# EAGLE board M1709 (EAGLE 6.6.0), part 1 of 2
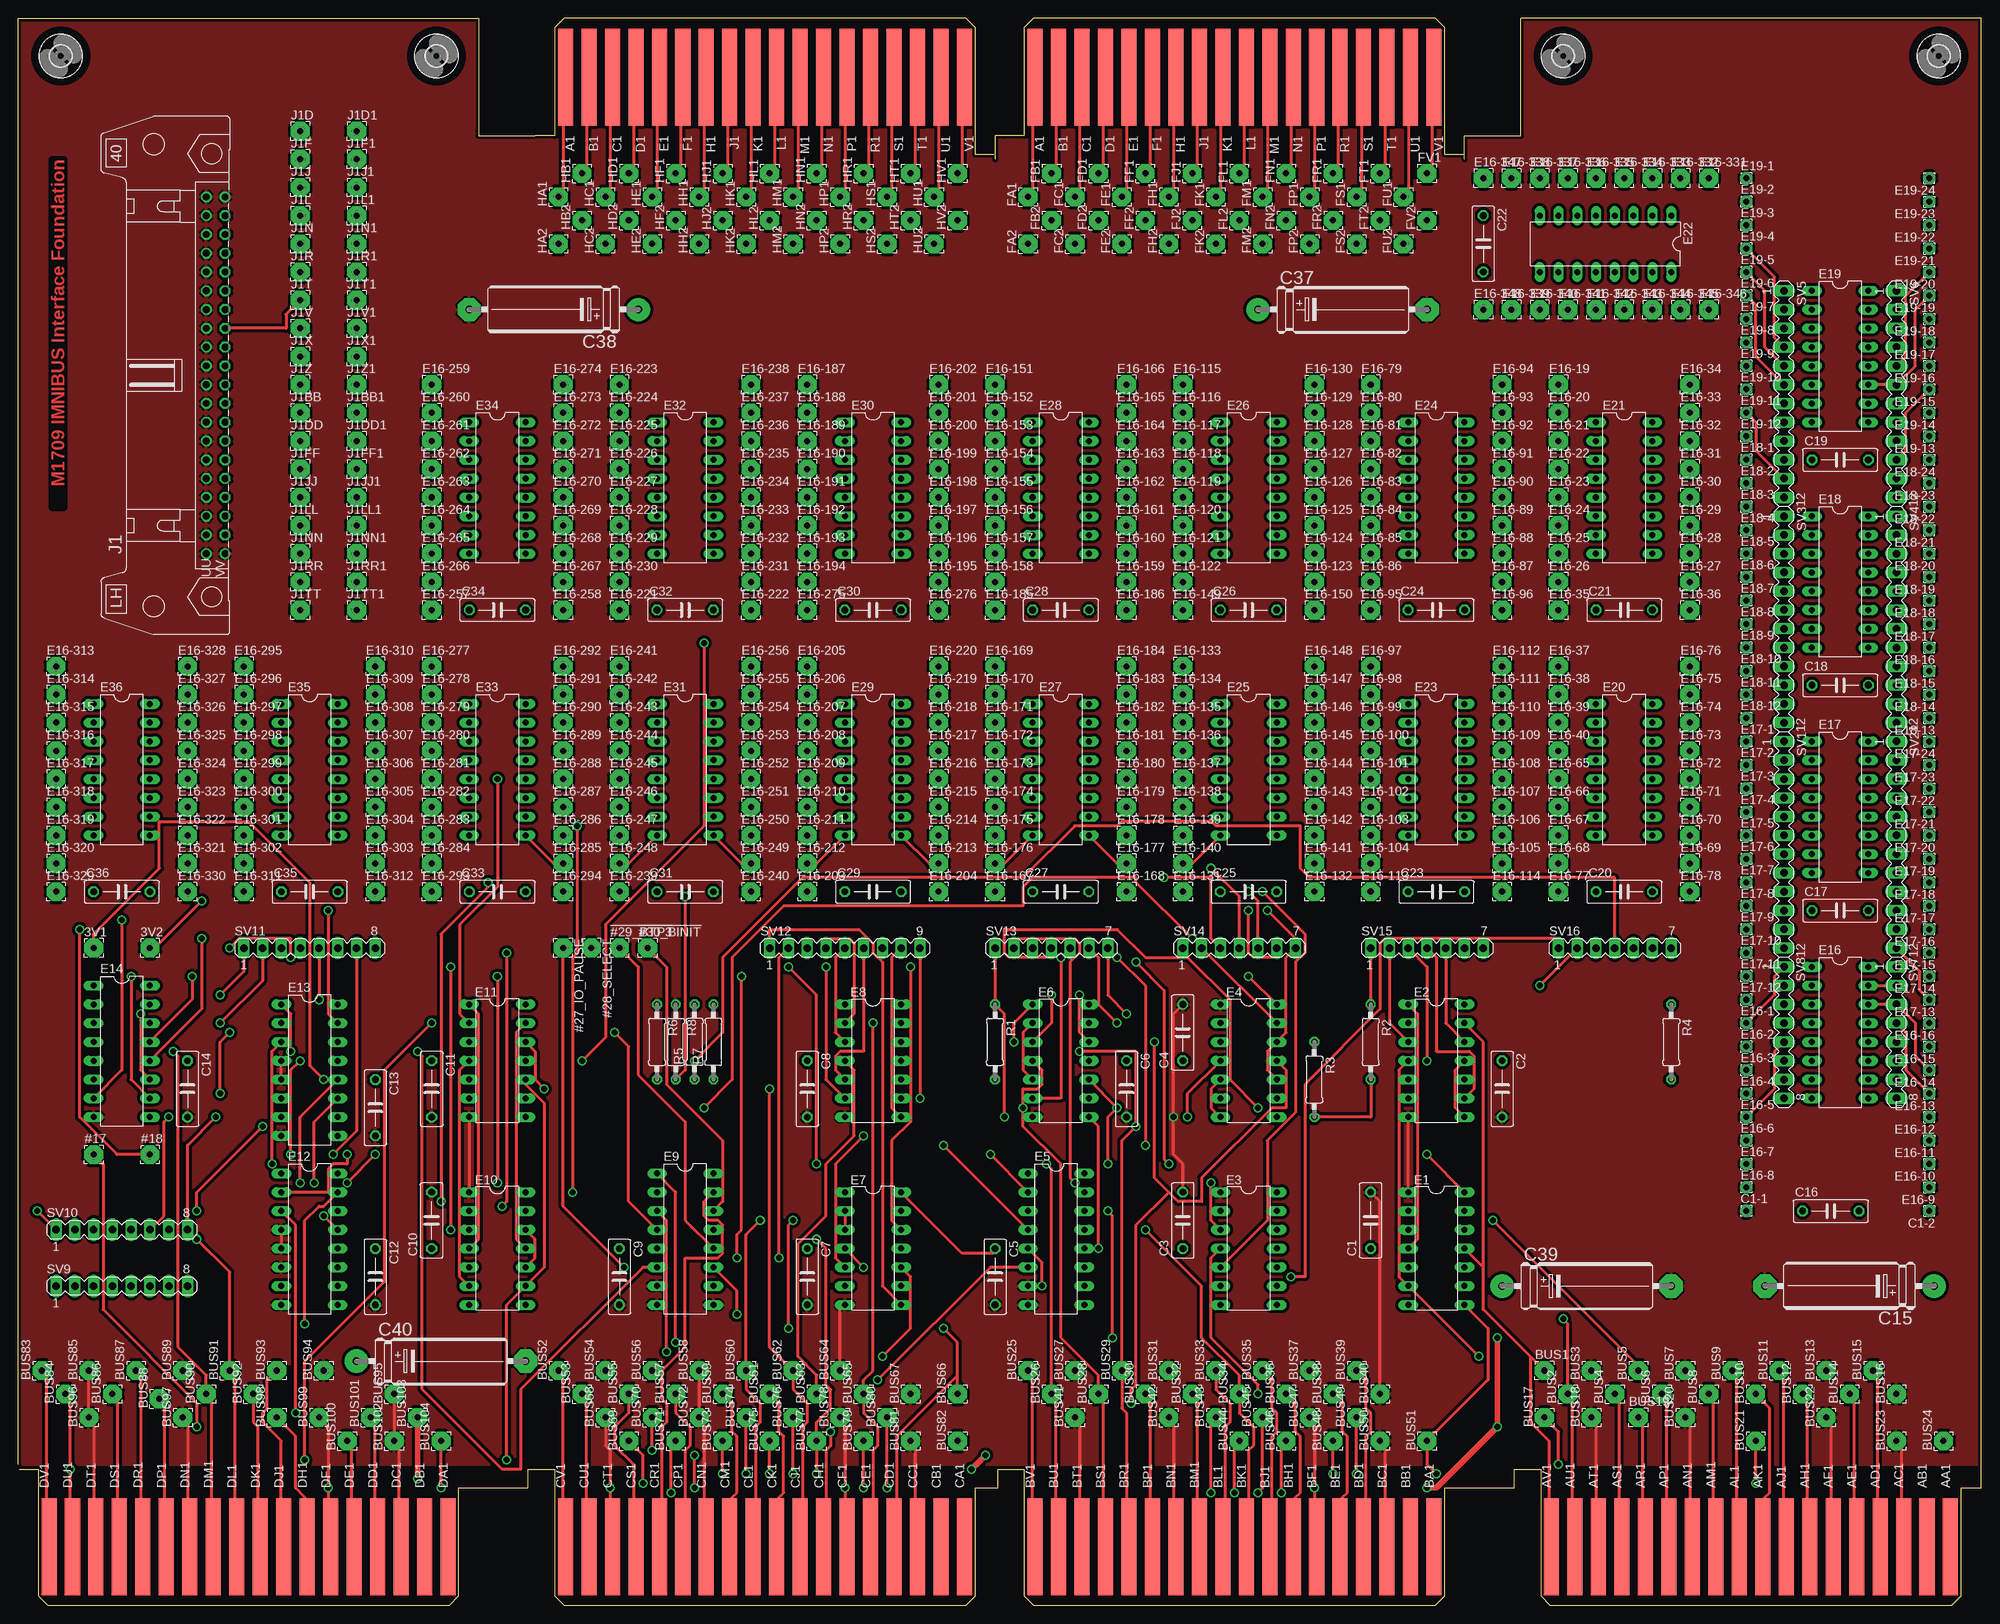
[diagram p3: board, top side]
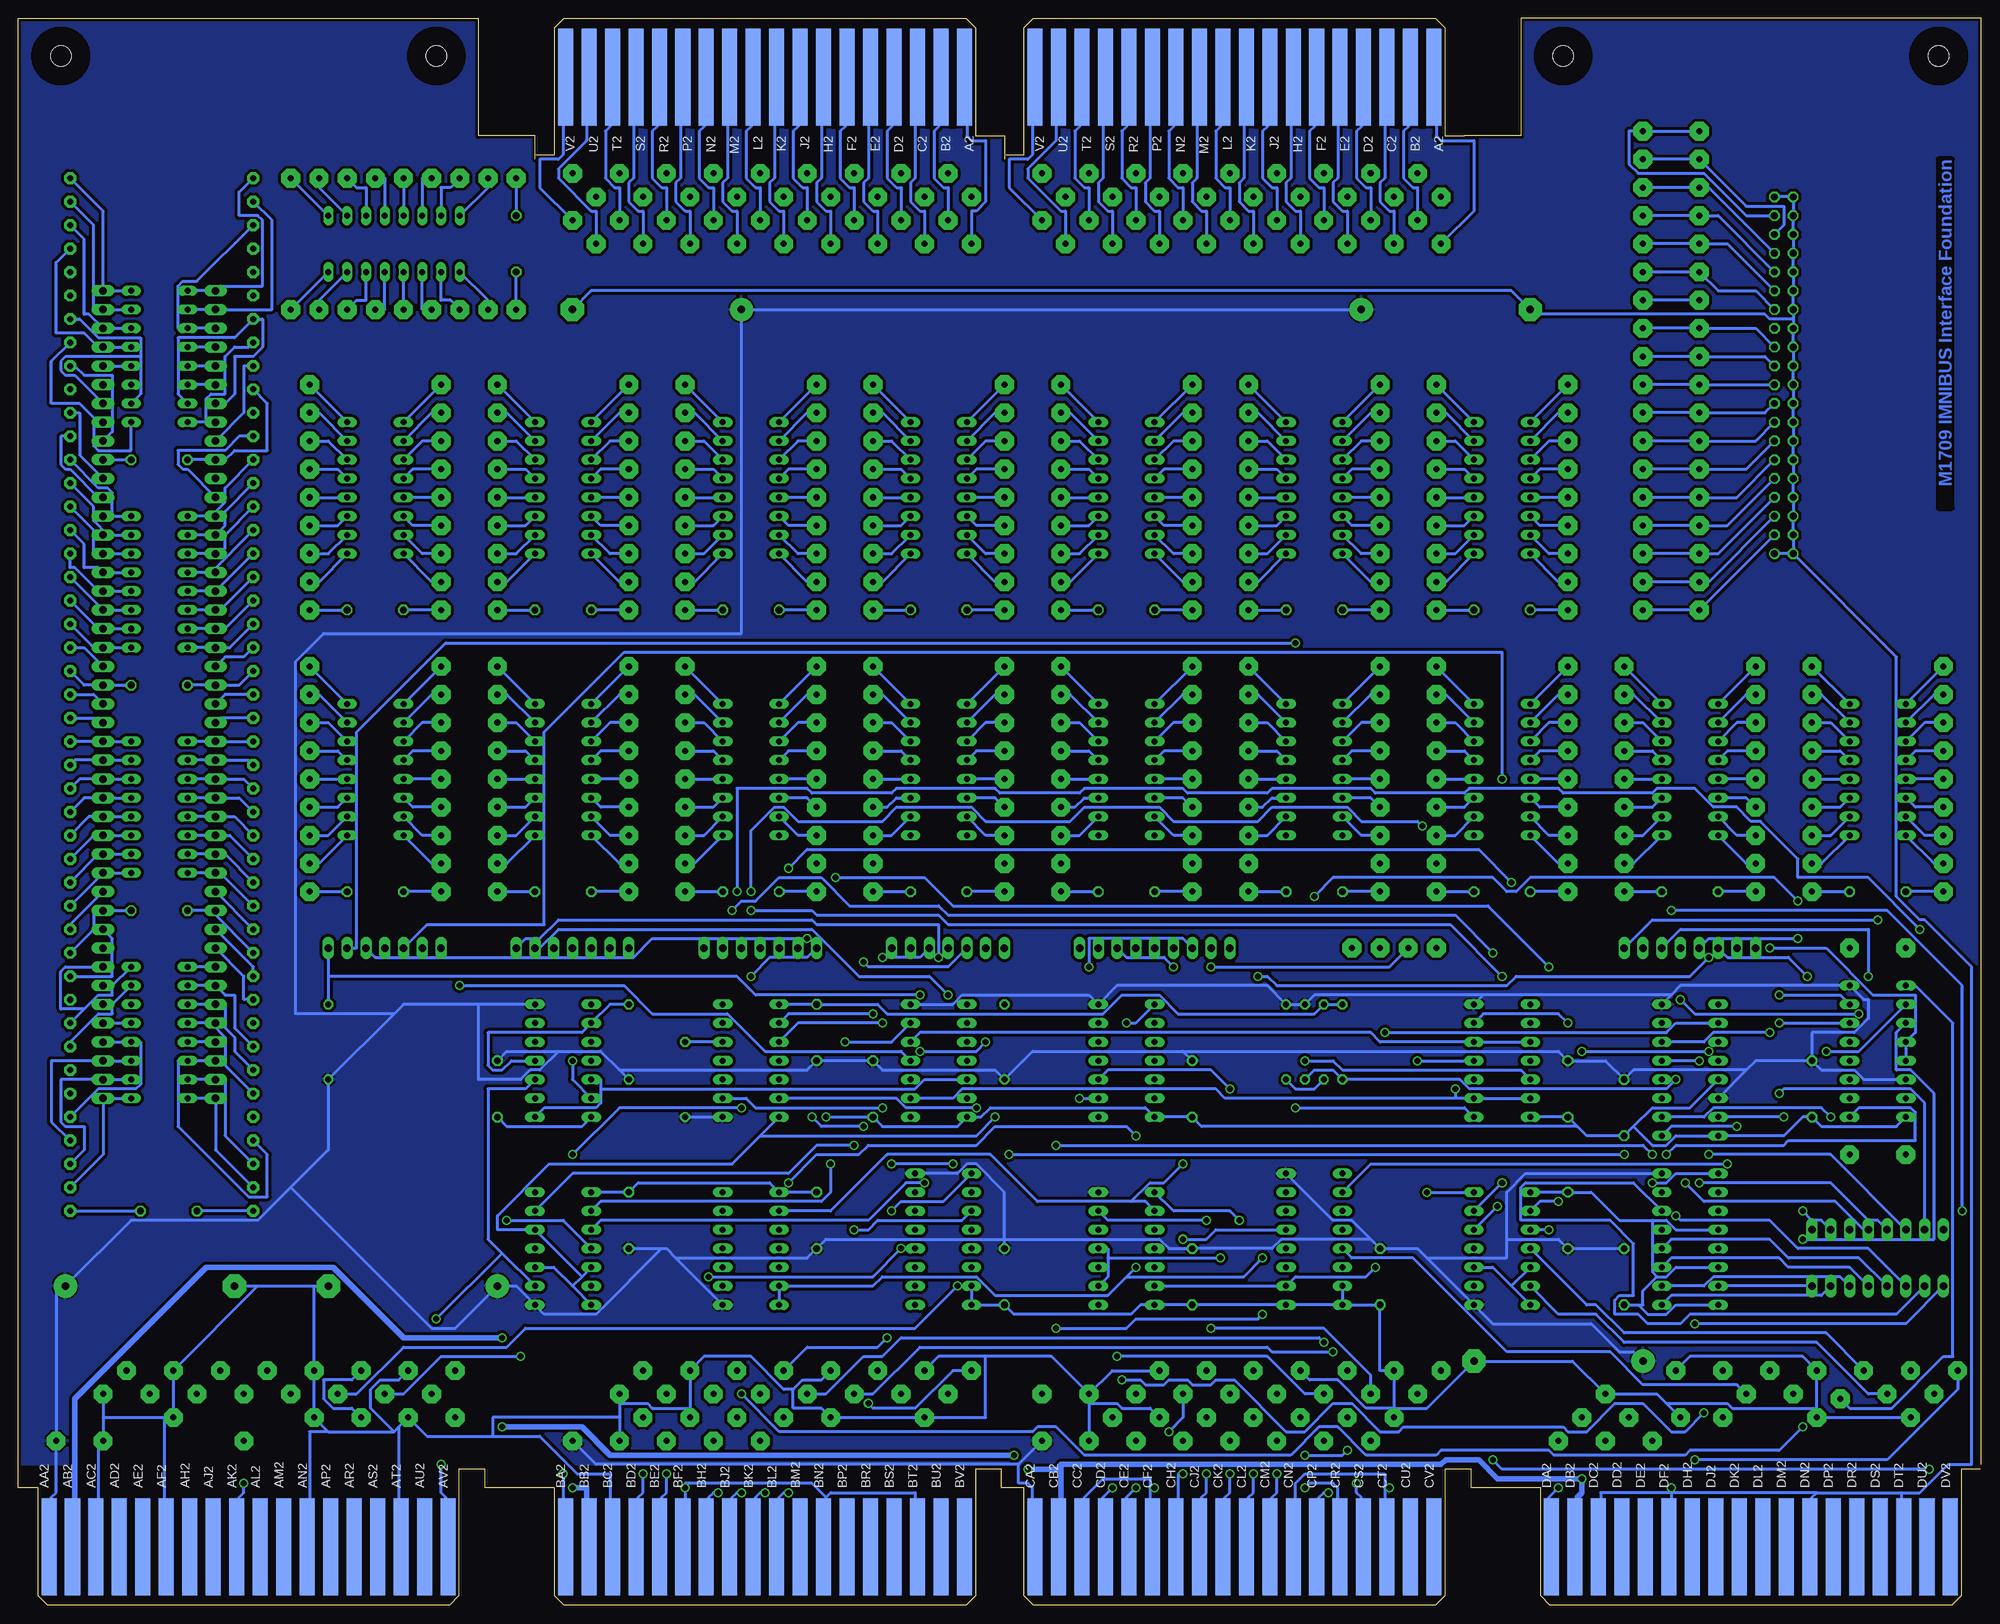
[diagram p4: board, bottom side, seen from below]

Size 265.43 x 214.63 mm. Coordinates in mm from the lower left corner, seen from the top.
Outline: 133.35,198.75 132.08,198.75 132.08,195.58
Outline: 0,19.05 0,214.63 62.23,214.63 62.23,199.39 62.23,198.75 69.85,198.75
Outline: 265.43,15.88 265.43,214.63 203.2,214.63 203.2,198.75 195.58,198.75 195.58,195.58
Copper layers (1+16): Top 0.035mm / dielectric 1.5mm / Bottom 0.035mm
Design rules "16mils": minimum track width 16mil, minimum drill 32mil, track to track 15mil, track to pad 10mil, pad to pad 10mil, via to via 10mil, smd to smd 10mil, copper to edge 13mil, drill to drill 10mil, minimum pad ring 10mil, minimum via ring 8mil, stop-mask expansion 0mil, vias tented up to drill 0mil, thermal gap 10mil
Net classes: 1 Supply: width 0.762 mm

## Footprints (pad centres in the part's own frame; a part is rotated, then mirrored left to right if it is on the bottom)
2,54/0,8 = drill 0.813 pad 2.54 octagon: 1 0,0
C075-032X103 = drill 0.914 octagon: 1 -3.81,0; 2 3.81,0
1,6/0,8 = drill 0.813 pad 1.6 octagon: 1 0,0
E22-6 = drill 1.016 pad 3.15: + -11.43,0 | drill 1.016 pad 3.15 octagon: - 11.43,0
DIL14 = drill 0.813 long: 1 -7.62,-3.81; 2 -5.08,-3.81; 3 -2.54,-3.81; 4 0,-3.81; 5 2.54,-3.81; 6 5.08,-3.81; 7 7.62,-3.81; 8 7.62,3.81; 9 5.08,3.81; 10 2.54,3.81; 11 0,3.81; 12 -2.54,3.81; 13 -5.08,3.81; 14 -7.62,3.81
DIL16 = drill 0.813 long: 1 -8.89,-3.81; 2 -6.35,-3.81; 3 -3.81,-3.81; 4 -1.27,-3.81; 5 1.27,-3.81; 6 3.81,-3.81; 7 6.35,-3.81; 8 8.89,-3.81; 9 8.89,3.81; 10 6.35,3.81; 11 3.81,3.81; 12 1.27,3.81; 13 -1.27,3.81; 14 -3.81,3.81; 15 -6.35,3.81; 16 -8.89,3.81
EDGE-CON2 = smd 13.106 x 2.032: A1 7.938,4.128; B1 7.938,7.303; C1 7.938,10.477; D1 7.938,13.652; E1 7.938,16.828; F1 7.938,20.003; H1 7.938,23.177; J1 7.938,26.352; K1 7.938,29.527; L1 7.938,32.703; M1 7.938,35.877; N1 7.938,39.053; P1 7.938,42.227; R1 7.938,45.403; S1 7.938,48.578; T1 7.938,51.752; U1 7.938,54.928; V1 7.938,58.102 | smd 13.106 x 2.032 bottom: A2 7.938,4.128; B2 7.938,7.303; C2 7.938,10.477; D2 7.938,13.652; E2 7.938,16.828; F2 7.938,20.003; H2 7.938,23.177; J2 7.938,26.352; K2 7.938,29.527; L2 7.938,32.703; M2 7.938,35.877; N2 7.938,39.053; P2 7.938,42.227; R2 7.938,45.403; S2 7.938,48.578; T2 7.938,51.752; U2 7.938,54.928; V2 7.938,58.102
DEC40PINH = drill 0.914 octagon: A 24.13,1.27; AA -3.81,1.27; B 24.13,-1.27; BB -3.81,-1.27; C 21.59,1.27; CC -6.35,1.27; D 21.59,-1.27; DD -6.35,-1.27; E 19.05,1.27; EE -8.89,1.27; F 19.05,-1.27; FF -8.89,-1.27; H 16.51,1.27; HH -11.43,1.27; J 16.51,-1.27; JJ -11.43,-1.27; K 13.97,1.27; KK -13.97,1.27; L 13.97,-1.27; LL -13.97,-1.27; M 11.43,1.27; MM -16.51,1.27; N 11.43,-1.27; NN -16.51,-1.27; P 8.89,1.27; PP -19.05,1.27; R 8.89,-1.27; RR -19.05,-1.27; S 6.35,1.27; SS -21.59,1.27; T 6.35,-1.27; TT -21.59,-1.27; U 3.81,1.27; UU -24.13,1.27; V 3.81,-1.27; W 1.27,1.27; X 1.27,-1.27; Y -1.27,1.27; Z -1.27,-1.27 | drill 0.914: VV -24.13,-1.27
0207/10 = drill 0.813 octagon: 1 -5.08,0; 2 5.08,0
MA12-1 = drill 1.016 long: 1 -13.97,0; 2 -11.43,0; 3 -8.89,0; 4 -6.35,0; 5 -3.81,0; 6 -1.27,0; 7 1.27,0; 8 3.81,0; 9 6.35,0; 10 8.89,0; 11 11.43,0; 12 13.97,0
MA08-1 = drill 1.016 long: 1 -8.89,0; 2 -6.35,0; 3 -3.81,0; 4 -1.27,0; 5 1.27,0; 6 3.81,0; 7 6.35,0; 8 8.89,0
MA09-1 = drill 1.016 long: 1 -10.16,0; 2 -7.62,0; 3 -5.08,0; 4 -2.54,0; 5 0,0; 6 2.54,0; 7 5.08,0; 8 7.62,0; 9 10.16,0
MA07-1 = drill 1.016 long: 1 -7.62,0; 2 -5.08,0; 3 -2.54,0; 4 0,0; 5 2.54,0; 6 5.08,0; 7 7.62,0
EDGE-CON8 = smd 2.032 x 13.106: AA1 261.303,7.938; AB1 258.127,7.938; AC1 254.952,7.938; AD1 251.778,7.938; AE1 248.602,7.938; AF1 245.428,7.938; AH1 242.252,7.938; AJ1 239.077,7.938; AK1 235.903,7.938; AL1 232.727,7.938; AM1 229.553,7.938; AN1 226.377,7.938; AP1 223.202,7.938; AR1 220.028,7.938; AS1 216.852,7.938; AT1 213.678,7.938; AU1 210.502,7.938; AV1 207.327,7.938; BA1 191.452,7.938; BB1 188.278,7.938; BC1 185.102,7.938; BD1 181.928,7.938; BE1 178.752,7.938; BF1 175.577,7.938; BH1 172.403,7.938; BJ1 169.227,7.938; BK1 166.053,7.938; BL1 162.877,7.938; BM1 159.702,7.938; BN1 156.528,7.938; BP1 153.352,7.938; BR1 150.178,7.938; BS1 147.002,7.938; BT1 143.827,7.938; BU1 140.653,7.938; BV1 137.477,7.938; CA1 127.953,7.938; CB1 124.778,7.938; CC1 121.603,7.938; CD1 118.427,7.938; CE1 115.252,7.938; CF1 112.078,7.938; CH1 108.903,7.938; CJ1 105.728,7.938; CK1 102.552,7.938; CL1 99.377,7.938; CM1 96.203,7.938; CN1 93.028,7.938; CP1 89.853,7.938; CR1 86.677,7.938; CS1 83.502,7.938; CT1 80.328,7.938; CU1 77.153,7.938; CV1 73.978,7.938; DA1 58.102,7.938; DB1 54.928,7.938; DC1 51.752,7.938; DD1 48.578,7.938; DE1 45.403,7.938; DF1 42.227,7.938; DH1 39.053,7.938; DJ1 35.877,7.938; DK1 32.703,7.938; DL1 29.527,7.938; DM1 26.352,7.938; DN1 23.177,7.938; DP1 20.003,7.938; DR1 16.828,7.938; DS1 13.652,7.938; DT1 10.477,7.938; DU1 7.303,7.938; DV1 4.128,7.938 | smd 2.032 x 13.106 bottom: AA2 261.303,7.938; AB2 258.127,7.938; AC2 254.952,7.938; AD2 251.778,7.938; AE2 248.602,7.938; AF2 245.428,7.938; AH2 242.252,7.938; AJ2 239.077,7.938; AK2 235.903,7.938; AL2 232.727,7.938; AM2 229.553,7.938; AN2 226.377,7.938; AP2 223.202,7.938; AR2 220.028,7.938; AS2 216.852,7.938; AT2 213.678,7.938; AU2 210.502,7.938; AV2 207.327,7.938; BA2 191.452,7.938; BB2 188.278,7.938; BC2 185.102,7.938; BD2 181.928,7.938; BE2 178.752,7.938; BF2 175.577,7.938; BH2 172.403,7.938; BJ2 169.227,7.938; BK2 166.053,7.938; BL2 162.877,7.938; BM2 159.702,7.938; BN2 156.528,7.938; BP2 153.352,7.938; BR2 150.178,7.938; BS2 147.002,7.938; BT2 143.827,7.938; BU2 140.653,7.938; BV2 137.477,7.938; CA2 127.953,7.938; CB2 124.778,7.938; CC2 121.603,7.938; CD2 118.427,7.938; CE2 115.252,7.938; CF2 112.078,7.938; CH2 108.903,7.938; CJ2 105.728,7.938; CK2 102.552,7.938; CL2 99.377,7.938; CM2 96.203,7.938; CN2 93.028,7.938; CP2 89.853,7.938; CR2 86.677,7.938; CS2 83.502,7.938; CT2 80.328,7.938; CU2 77.153,7.938; CV2 73.978,7.938; DA2 58.102,7.938; DB2 54.928,7.938; DC2 51.752,7.938; DD2 48.578,7.938; DE2 45.403,7.938; DF2 42.227,7.938; DH2 39.053,7.938; DJ2 35.877,7.938; DK2 32.703,7.938; DL2 29.527,7.938; DM2 26.352,7.938; DN2 23.177,7.938; DP2 20.003,7.938; DR2 16.828,7.938; DS2 13.652,7.938; DT2 10.477,7.938; DU2 7.303,7.938; DV2 4.128,7.938
2,8 = hole 2.8: 0,0

## Placement (x,y rotation side)
3V1  [2,54/0,8]  10.16,88.9 0 top
3V2  [2,54/0,8]  17.78,88.9 0 top
!#29_BTP3  29  [2,54/0,8]  81.28,88.9 0 top
!#30_BINIT  30  [2,54/0,8]  85.09,88.9 0 top
#17  17  [2,54/0,8]  10.16,60.96 0 top
#18  18  [2,54/0,8]  17.78,60.96 0 top
#27_IO_PAUSE  27  [2,54/0,8]  73.66,88.9 270 top
#28_SELECT  28  [2,54/0,8]  77.47,88.9 270 top
BUS1  [2,54/0,8]  206.38,31.75 0 top
BUS2  [2,54/0,8]  209.55,28.57 90 top
BUS3  [2,54/0,8]  212.72,31.75 90 top
BUS4  [2,54/0,8]  215.9,28.57 90 top
BUS5  [2,54/0,8]  219.07,31.75 90 top
BUS6  [2,54/0,8]  222.25,28.57 90 top
BUS7  [2,54/0,8]  225.43,31.75 90 top
BUS8  [2,54/0,8]  228.6,28.57 90 top
BUS9  [2,54/0,8]  231.78,31.75 90 top
BUS10  [2,54/0,8]  234.95,28.57 90 top
BUS11  [2,54/0,8]  238.12,31.75 90 top
BUS12  [2,54/0,8]  241.3,28.57 90 top
BUS13  [2,54/0,8]  244.47,31.75 90 top
BUS14  [2,54/0,8]  247.65,28.57 90 top
BUS15  [2,54/0,8]  250.82,31.75 90 top
BUS16  [2,54/0,8]  254,28.57 90 top
BUS17  [2,54/0,8]  206.38,25.4 90 top
BUS18  [2,54/0,8]  212.72,25.4 90 top
BUS19  [2,54/0,8]  219.07,25.4 0 top
BUS20  [2,54/0,8]  225.43,25.4 90 top
BUS21  [2,54/0,8]  234.95,22.23 90 top
BUS22  [2,54/0,8]  244.47,25.4 90 top
BUS23  [2,54/0,8]  254,22.23 90 top
BUS24  [2,54/0,8]  260.35,22.23 90 top
BUS25  [2,54/0,8]  136.53,31.75 90 top
BUS26  [2,54/0,8]  139.7,28.57 90 top
BUS27  [2,54/0,8]  142.88,31.75 90 top
BUS28  [2,54/0,8]  146.05,28.57 90 top
BUS29  [2,54/0,8]  149.22,31.75 90 top
BUS30  [2,54/0,8]  152.4,28.57 90 top
BUS31  [2,54/0,8]  155.57,31.75 90 top
BUS32  [2,54/0,8]  158.75,28.57 90 top
BUS33  [2,54/0,8]  161.93,31.75 90 top
BUS34  [2,54/0,8]  165.1,28.57 90 top
BUS35  [2,54/0,8]  168.28,31.75 90 top
BUS36  [2,54/0,8]  171.45,28.57 90 top
BUS37  [2,54/0,8]  174.62,31.75 90 top
BUS38  [2,54/0,8]  177.8,28.57 90 top
BUS39  [2,54/0,8]  180.97,31.75 90 top
BUS40  [2,54/0,8]  184.15,28.57 90 top
BUS41  [2,54/0,8]  142.88,25.4 90 top
BUS42  [2,54/0,8]  155.57,25.4 90 top
BUS43  [2,54/0,8]  161.93,25.4 90 top
BUS44  [2,54/0,8]  165.1,22.23 90 top
BUS45  [2,54/0,8]  168.28,25.4 90 top
BUS46  [2,54/0,8]  171.45,22.23 90 top
BUS47  [2,54/0,8]  174.62,25.4 90 top
BUS48  [2,54/0,8]  177.8,22.23 90 top
BUS49  [2,54/0,8]  180.97,25.4 90 top
BUS50  [2,54/0,8]  184.15,22.23 90 top
BUS51  [2,54/0,8]  190.5,22.23 90 top
BUS52  [2,54/0,8]  73.03,31.75 90 top
BUS53  [2,54/0,8]  76.2,28.57 90 top
BUS54  [2,54/0,8]  79.38,31.75 90 top
BUS55  [2,54/0,8]  82.55,28.57 90 top
BUS56  [2,54/0,8]  85.72,31.75 90 top
BUS57  [2,54/0,8]  88.9,28.57 90 top
BUS58  [2,54/0,8]  92.08,31.75 90 top
BUS59  [2,54/0,8]  95.25,28.57 90 top
BUS60  [2,54/0,8]  98.42,31.75 90 top
BUS61  [2,54/0,8]  101.6,28.57 90 top
BUS62  [2,54/0,8]  104.78,31.75 90 top
BUS63  [2,54/0,8]  107.95,28.57 90 top
BUS64  [2,54/0,8]  111.12,31.75 90 top
BUS65  [2,54/0,8]  114.3,28.57 90 top
BUS66  [2,54/0,8]  127,28.57 90 top
BUS67  [2,54/0,8]  120.65,28.57 90 top
BUS68  [2,54/0,8]  79.38,25.4 90 top
BUS69  [2,54/0,8]  82.55,22.23 90 top
BUS70  [2,54/0,8]  85.72,25.4 90 top
BUS71  [2,54/0,8]  88.9,22.23 90 top
BUS72  [2,54/0,8]  92.08,25.4 90 top
BUS73  [2,54/0,8]  95.25,22.23 90 top
BUS74  [2,54/0,8]  98.42,25.4 90 top
BUS75  [2,54/0,8]  101.6,22.23 90 top
BUS76  [2,54/0,8]  104.78,25.4 90 top
BUS77  [2,54/0,8]  107.95,22.23 90 top
BUS78  [2,54/0,8]  111.12,25.4 90 top
BUS79  [2,54/0,8]  114.3,22.23 90 top
BUS80  [2,54/0,8]  117.47,25.4 90 top
BUS81  [2,54/0,8]  120.65,22.23 90 top
BUS82  [2,54/0,8]  127,22.23 90 top
BUS83  [2,54/0,8]  3.17,31.75 90 top
BUS84  [2,54/0,8]  6.35,28.57 90 top
BUS85  [2,54/0,8]  9.53,31.75 90 top
BUS86  [2,54/0,8]  12.7,28.57 90 top
BUS87  [2,54/0,8]  15.88,31.75 90 top
BUS88  [2,54/0,8]  19.05,27.94 90 top
BUS89  [2,54/0,8]  22.23,31.75 90 top
BUS90  [2,54/0,8]  25.4,28.57 90 top
BUS91  [2,54/0,8]  28.57,31.75 90 top
BUS92  [2,54/0,8]  31.75,28.57 90 top
BUS93  [2,54/0,8]  34.92,31.75 90 top
BUS94  [2,54/0,8]  41.27,31.75 90 top
BUS95  [2,54/0,8]  50.8,28.57 90 top
BUS96  [2,54/0,8]  9.53,25.4 90 top
BUS97  [2,54/0,8]  22.23,25.4 90 top
BUS98  [2,54/0,8]  34.92,25.4 90 top
BUS99  [2,54/0,8]  40.64,25.4 90 top
BUS100  [2,54/0,8]  44.45,22.23 90 top
BUS101  [2,54/0,8]  47.62,25.4 90 top
BUS102  [2,54/0,8]  50.8,22.23 90 top
BUS103  [2,54/0,8]  53.98,25.4 90 top
BUS104  [2,54/0,8]  57.15,22.23 90 top
C1  [C075-032X103]  182.88,52.07 90 top
C1-1  [1,6/0,8]  233.68,53.34 0 top
C1-2  [1,6/0,8]  258.44,53.34 180 top
C2  [C075-032X103]  200.66,69.85 270 top
C3  [C075-032X103]  157.48,52.07 90 top
C4  [C075-032X103]  157.48,77.47 90 top
C5  [C075-032X103]  132.08,44.45 270 top
C6  [C075-032X103]  149.86,69.85 270 top
C7  [C075-032X103]  106.68,44.45 270 top
C8  [C075-032X103]  106.68,69.85 270 top
C9  [C075-032X103]  81.28,44.45 270 top
C10  [C075-032X103]  55.88,52.07 90 top
C11  [C075-032X103]  55.88,69.85 270 top
C12  [C075-032X103]  48.26,44.45 270 top
C13  [C075-032X103]  48.26,67.31 270 top
C14  [C075-032X103]  22.86,69.85 270 top
C15  [E22-6]  247.65,43.18 180 top
C16  [C075-032X103]  245.11,53.34 0 top
C17  [C075-032X103]  246.38,93.98 0 top
C18  [C075-032X103]  246.38,124.46 0 top
C19  [C075-032X103]  246.38,154.94 0 top
C20  [C075-032X103]  217.17,96.52 0 top
C21  [C075-032X103]  217.17,134.62 0 top
C22  [C075-032X103]  198.12,184.15 270 top
C23  [C075-032X103]  191.77,96.52 0 top
C24  [C075-032X103]  191.77,134.62 0 top
C25  [C075-032X103]  166.37,96.52 0 top
C26  [C075-032X103]  166.37,134.62 0 top
C27  [C075-032X103]  140.97,96.52 0 top
C28  [C075-032X103]  140.97,134.62 0 top
C29  [C075-032X103]  115.57,96.52 0 top
C30  [C075-032X103]  115.57,134.62 0 top
C31  [C075-032X103]  90.17,96.52 0 top
C32  [C075-032X103]  90.17,134.62 0 top
C33  [C075-032X103]  64.77,96.52 0 top
C34  [C075-032X103]  64.77,134.62 0 top
C35  [C075-032X103]  39.37,96.52 0 top
C36  [C075-032X103]  13.97,96.52 0 top
C37  [E22-6]  179.07,175.26 0 top
C38  [E22-6]  72.39,175.26 180 top
C39  [E22-6]  212.09,43.18 0 top
C40  [E22-6]  57.15,33.02 0 top
E1  SP380N  [DIL14]  191.77,48.26 270 top
E2  DEC8881  [DIL14]  191.77,73.66 270 top
E3  SP380N  [DIL14]  166.37,48.26 270 top
E4  SP380N  [DIL14]  166.37,73.66 270 top
E5  DS8837N  [DIL16]  140.34,49.53 270 top
E6  DEC8881  [DIL14]  140.97,73.66 270 top
E7  DEC8881  [DIL14]  115.57,48.26 270 top
E8  DEC8881  [DIL14]  115.57,73.66 270 top
E9  DS8837N  [DIL16]  90.17,49.53 270 top
E10  SP380N  [DIL14]  64.77,48.26 270 top
E11  DEC8881  [DIL14]  64.77,73.66 270 top
E12  74LS138N  [DIL16]  39.37,49.53 270 top
E13  74LS138N  [DIL16]  39.37,72.39 270 top
E14  74LS138N  [DIL16]  13.97,74.93 270 top
E16  [DIL16]  246.38,77.47 270 top
E16-1  [1,6/0,8]  233.68,78.74 0 top
E16-2  [1,6/0,8]  233.68,75.56 0 top
E16-3  [1,6/0,8]  233.68,72.39 0 top
E16-4  [1,6/0,8]  233.68,69.22 0 top
E16-5  [1,6/0,8]  233.68,66.04 0 top
E16-6  [1,6/0,8]  233.68,62.87 0 top
E16-7  [1,6/0,8]  233.68,59.69 0 top
E16-8  [1,6/0,8]  233.68,56.52 0 top
E16-9  [1,6/0,8]  258.44,56.52 180 top
E16-10  [1,6/0,8]  258.44,59.69 180 top
E16-11  [1,6/0,8]  258.44,62.87 180 top
E16-12  [1,6/0,8]  258.44,66.04 180 top
E16-13  [1,6/0,8]  258.44,69.22 180 top
E16-14  [1,6/0,8]  258.44,72.39 180 top
E16-15  [1,6/0,8]  258.44,75.56 180 top
E16-16  [1,6/0,8]  258.44,78.74 180 top
E16-19  [2,54/0,8]  208.28,165.1 0 top
E16-20  [2,54/0,8]  208.28,161.29 0 top
E16-21  [2,54/0,8]  208.28,157.48 0 top
E16-22  [2,54/0,8]  208.28,153.67 0 top
E16-23  [2,54/0,8]  208.28,149.86 0 top
E16-24  [2,54/0,8]  208.28,146.05 0 top
E16-25  [2,54/0,8]  208.28,142.24 0 top
E16-26  [2,54/0,8]  208.28,138.43 0 top
E16-27  [2,54/0,8]  226.06,138.43 0 top
E16-28  [2,54/0,8]  226.06,142.24 0 top
E16-29  [2,54/0,8]  226.06,146.05 0 top
E16-30  [2,54/0,8]  226.06,149.86 0 top
E16-31  [2,54/0,8]  226.06,153.67 0 top
E16-32  [2,54/0,8]  226.06,157.48 0 top
E16-33  [2,54/0,8]  226.06,161.29 0 top
E16-34  [2,54/0,8]  226.06,165.1 0 top
E16-35  [2,54/0,8]  208.28,134.62 0 top
E16-36  [2,54/0,8]  226.06,134.62 0 top
E16-37  [2,54/0,8]  208.28,127 0 top
E16-38  [2,54/0,8]  208.28,123.19 0 top
E16-39  [2,54/0,8]  208.28,119.38 0 top
E16-40  [2,54/0,8]  208.28,115.57 0 top
E16-65  [2,54/0,8]  208.28,111.76 0 top
E16-66  [2,54/0,8]  208.28,107.95 0 top
E16-67  [2,54/0,8]  208.28,104.14 0 top
E16-68  [2,54/0,8]  208.28,100.33 0 top
E16-69  [2,54/0,8]  226.06,100.33 0 top
E16-70  [2,54/0,8]  226.06,104.14 0 top
E16-71  [2,54/0,8]  226.06,107.95 0 top
E16-72  [2,54/0,8]  226.06,111.76 0 top
E16-73  [2,54/0,8]  226.06,115.57 0 top
E16-74  [2,54/0,8]  226.06,119.38 0 top
E16-75  [2,54/0,8]  226.06,123.19 0 top
E16-76  [2,54/0,8]  226.06,127 0 top
E16-77  [2,54/0,8]  208.28,96.52 0 top
E16-78  [2,54/0,8]  226.06,96.52 0 top
E16-79  [2,54/0,8]  182.88,165.1 0 top
E16-80  [2,54/0,8]  182.88,161.29 0 top
E16-81  [2,54/0,8]  182.88,157.48 0 top
E16-82  [2,54/0,8]  182.88,153.67 0 top
E16-83  [2,54/0,8]  182.88,149.86 0 top
E16-84  [2,54/0,8]  182.88,146.05 0 top
E16-85  [2,54/0,8]  182.88,142.24 0 top
E16-86  [2,54/0,8]  182.88,138.43 0 top
E16-87  [2,54/0,8]  200.66,138.43 0 top
E16-88  [2,54/0,8]  200.66,142.24 0 top
E16-89  [2,54/0,8]  200.66,146.05 0 top
E16-90  [2,54/0,8]  200.66,149.86 0 top
E16-91  [2,54/0,8]  200.66,153.67 0 top
E16-92  [2,54/0,8]  200.66,157.48 0 top
E16-93  [2,54/0,8]  200.66,161.29 0 top
E16-94  [2,54/0,8]  200.66,165.1 0 top
E16-95  [2,54/0,8]  182.88,134.62 0 top
E16-96  [2,54/0,8]  200.66,134.62 0 top
E16-97  [2,54/0,8]  182.88,127 0 top
E16-98  [2,54/0,8]  182.88,123.19 0 top
E16-99  [2,54/0,8]  182.88,119.38 0 top
E16-100  [2,54/0,8]  182.88,115.57 0 top
E16-101  [2,54/0,8]  182.88,111.76 0 top
E16-102  [2,54/0,8]  182.88,107.95 0 top
E16-103  [2,54/0,8]  182.88,104.14 0 top
E16-104  [2,54/0,8]  182.88,100.33 0 top
E16-105  [2,54/0,8]  200.66,100.33 0 top
E16-106  [2,54/0,8]  200.66,104.14 0 top
E16-107  [2,54/0,8]  200.66,107.95 0 top
E16-108  [2,54/0,8]  200.66,111.76 0 top
E16-109  [2,54/0,8]  200.66,115.57 0 top
E16-110  [2,54/0,8]  200.66,119.38 0 top
E16-111  [2,54/0,8]  200.66,123.19 0 top
E16-112  [2,54/0,8]  200.66,127 0 top
E16-113  [2,54/0,8]  182.88,96.52 0 top
E16-114  [2,54/0,8]  200.66,96.52 0 top
E16-115  [2,54/0,8]  157.48,165.1 0 top
E16-116  [2,54/0,8]  157.48,161.29 0 top
E16-117  [2,54/0,8]  157.48,157.48 0 top
E16-118  [2,54/0,8]  157.48,153.67 0 top
E16-119  [2,54/0,8]  157.48,149.86 0 top
E16-120  [2,54/0,8]  157.48,146.05 0 top
E16-121  [2,54/0,8]  157.48,142.24 0 top
E16-122  [2,54/0,8]  157.48,138.43 0 top
E16-123  [2,54/0,8]  175.26,138.43 0 top
E16-124  [2,54/0,8]  175.26,142.24 0 top
E16-125  [2,54/0,8]  175.26,146.05 0 top
E16-126  [2,54/0,8]  175.26,149.86 0 top
E16-127  [2,54/0,8]  175.26,153.67 0 top
E16-128  [2,54/0,8]  175.26,157.48 0 top
E16-129  [2,54/0,8]  175.26,161.29 0 top
E16-130  [2,54/0,8]  175.26,165.1 0 top
E16-131  [2,54/0,8]  157.48,96.52 0 top
E16-132  [2,54/0,8]  175.26,96.52 0 top
E16-133  [2,54/0,8]  157.48,127 0 top
E16-134  [2,54/0,8]  157.48,123.19 0 top
E16-135  [2,54/0,8]  157.48,119.38 0 top
E16-136  [2,54/0,8]  157.48,115.57 0 top
E16-137  [2,54/0,8]  157.48,111.76 0 top
E16-138  [2,54/0,8]  157.48,107.95 0 top
E16-139  [2,54/0,8]  157.48,104.14 0 top
E16-140  [2,54/0,8]  157.48,100.33 0 top
E16-141  [2,54/0,8]  175.26,100.33 0 top
E16-142  [2,54/0,8]  175.26,104.14 0 top
E16-143  [2,54/0,8]  175.26,107.95 0 top
E16-144  [2,54/0,8]  175.26,111.76 0 top
E16-145  [2,54/0,8]  175.26,115.57 0 top
E16-146  [2,54/0,8]  175.26,119.38 0 top
E16-147  [2,54/0,8]  175.26,123.19 0 top
E16-148  [2,54/0,8]  175.26,127 0 top
E16-149  [2,54/0,8]  157.48,134.62 0 top
E16-150  [2,54/0,8]  175.26,134.62 0 top
E16-151  [2,54/0,8]  132.08,165.1 0 top
E16-152  [2,54/0,8]  132.08,161.29 0 top
E16-153  [2,54/0,8]  132.08,157.48 0 top
E16-154  [2,54/0,8]  132.08,153.67 0 top
E16-155  [2,54/0,8]  132.08,149.86 0 top
E16-156  [2,54/0,8]  132.08,146.05 0 top
E16-157  [2,54/0,8]  132.08,142.24 0 top
E16-158  [2,54/0,8]  132.08,138.43 0 top
E16-159  [2,54/0,8]  149.86,138.43 0 top
E16-160  [2,54/0,8]  149.86,142.24 0 top
E16-161  [2,54/0,8]  149.86,146.05 0 top
E16-162  [2,54/0,8]  149.86,149.86 0 top
E16-163  [2,54/0,8]  149.86,153.67 0 top
E16-164  [2,54/0,8]  149.86,157.48 0 top
E16-165  [2,54/0,8]  149.86,161.29 0 top
E16-166  [2,54/0,8]  149.86,165.1 0 top
E16-167  [2,54/0,8]  132.08,96.52 0 top
E16-168  [2,54/0,8]  149.86,96.52 0 top
E16-169  [2,54/0,8]  132.08,127 0 top
E16-170  [2,54/0,8]  132.08,123.19 0 top
E16-171  [2,54/0,8]  132.08,119.38 0 top
E16-172  [2,54/0,8]  132.08,115.57 0 top
E16-173  [2,54/0,8]  132.08,111.76 0 top
E16-174  [2,54/0,8]  132.08,107.95 0 top
E16-175  [2,54/0,8]  132.08,104.14 0 top
E16-176  [2,54/0,8]  132.08,100.33 0 top
E16-177  [2,54/0,8]  149.86,100.33 0 top
E16-178  [2,54/0,8]  149.86,104.14 0 top
E16-179  [2,54/0,8]  149.86,107.95 0 top
E16-180  [2,54/0,8]  149.86,111.76 0 top
E16-181  [2,54/0,8]  149.86,115.57 0 top
E16-182  [2,54/0,8]  149.86,119.38 0 top
E16-183  [2,54/0,8]  149.86,123.19 0 top
E16-184  [2,54/0,8]  149.86,127 0 top
E16-185  [2,54/0,8]  132.08,134.62 0 top
E16-186  [2,54/0,8]  149.86,134.62 0 top
E16-187  [2,54/0,8]  106.68,165.1 0 top
E16-188  [2,54/0,8]  106.68,161.29 0 top
E16-189  [2,54/0,8]  106.68,157.48 0 top
E16-190  [2,54/0,8]  106.68,153.67 0 top
E16-191  [2,54/0,8]  106.68,149.86 0 top
E16-192  [2,54/0,8]  106.68,146.05 0 top
E16-193  [2,54/0,8]  106.68,142.24 0 top
E16-194  [2,54/0,8]  106.68,138.43 0 top
E16-195  [2,54/0,8]  124.46,138.43 0 top
E16-196  [2,54/0,8]  124.46,142.24 0 top
E16-197  [2,54/0,8]  124.46,146.05 0 top
E16-198  [2,54/0,8]  124.46,149.86 0 top
E16-199  [2,54/0,8]  124.46,153.67 0 top
E16-200  [2,54/0,8]  124.46,157.48 0 top
E16-201  [2,54/0,8]  124.46,161.29 0 top
E16-202  [2,54/0,8]  124.46,165.1 0 top
E16-203  [2,54/0,8]  106.68,96.52 0 top
E16-204  [2,54/0,8]  124.46,96.52 0 top
E16-205  [2,54/0,8]  106.68,127 0 top
E16-206  [2,54/0,8]  106.68,123.19 0 top
E16-207  [2,54/0,8]  106.68,119.38 0 top
E16-208  [2,54/0,8]  106.68,115.57 0 top
E16-209  [2,54/0,8]  106.68,111.76 0 top
E16-210  [2,54/0,8]  106.68,107.95 0 top
E16-211  [2,54/0,8]  106.68,104.14 0 top
E16-212  [2,54/0,8]  106.68,100.33 0 top
E16-213  [2,54/0,8]  124.46,100.33 0 top
E16-214  [2,54/0,8]  124.46,104.14 0 top
E16-215  [2,54/0,8]  124.46,107.95 0 top
E16-216  [2,54/0,8]  124.46,111.76 0 top
E16-217  [2,54/0,8]  124.46,115.57 0 top
E16-218  [2,54/0,8]  124.46,119.38 0 top
E16-219  [2,54/0,8]  124.46,123.19 0 top
E16-220  [2,54/0,8]  124.46,127 0 top
E16-221  [2,54/0,8]  81.28,134.62 0 top
E16-222  [2,54/0,8]  99.06,134.62 0 top
E16-223  [2,54/0,8]  81.28,165.1 0 top
E16-224  [2,54/0,8]  81.28,161.29 0 top
E16-225  [2,54/0,8]  81.28,157.48 0 top
E16-226  [2,54/0,8]  81.28,153.67 0 top
E16-227  [2,54/0,8]  81.28,149.86 0 top
E16-228  [2,54/0,8]  81.28,146.05 0 top
E16-229  [2,54/0,8]  81.28,142.24 0 top
E16-230  [2,54/0,8]  81.28,138.43 0 top
E16-231  [2,54/0,8]  99.06,138.43 0 top
E16-232  [2,54/0,8]  99.06,142.24 0 top
E16-233  [2,54/0,8]  99.06,146.05 0 top
E16-234  [2,54/0,8]  99.06,149.86 0 top
E16-235  [2,54/0,8]  99.06,153.67 0 top
E16-236  [2,54/0,8]  99.06,157.48 0 top
E16-237  [2,54/0,8]  99.06,161.29 0 top
E16-238  [2,54/0,8]  99.06,165.1 0 top
E16-239  [2,54/0,8]  81.28,96.52 0 top
E16-240  [2,54/0,8]  99.06,96.52 0 top
E16-241  [2,54/0,8]  81.28,127 0 top
E16-242  [2,54/0,8]  81.28,123.19 0 top
E16-243  [2,54/0,8]  81.28,119.38 0 top
E16-244  [2,54/0,8]  81.28,115.57 0 top
E16-245  [2,54/0,8]  81.28,111.76 0 top
E16-246  [2,54/0,8]  81.28,107.95 0 top
E16-247  [2,54/0,8]  81.28,104.14 0 top
E16-248  [2,54/0,8]  81.28,100.33 0 top
E16-249  [2,54/0,8]  99.06,100.33 0 top
E16-250  [2,54/0,8]  99.06,104.14 0 top
E16-251  [2,54/0,8]  99.06,107.95 0 top
E16-252  [2,54/0,8]  99.06,111.76 0 top
E16-253  [2,54/0,8]  99.06,115.57 0 top
E16-254  [2,54/0,8]  99.06,119.38 0 top
E16-255  [2,54/0,8]  99.06,123.19 0 top
E16-256  [2,54/0,8]  99.06,127 0 top
E16-257  [2,54/0,8]  55.88,134.62 0 top
E16-258  [2,54/0,8]  73.66,134.62 0 top
E16-259  [2,54/0,8]  55.88,165.1 0 top
E16-260  [2,54/0,8]  55.88,161.29 0 top
E16-261  [2,54/0,8]  55.88,157.48 0 top
E16-262  [2,54/0,8]  55.88,153.67 0 top
E16-263  [2,54/0,8]  55.88,149.86 0 top
E16-264  [2,54/0,8]  55.88,146.05 0 top
E16-265  [2,54/0,8]  55.88,142.24 0 top
E16-266  [2,54/0,8]  55.88,138.43 0 top
E16-267  [2,54/0,8]  73.66,138.43 0 top
E16-268  [2,54/0,8]  73.66,142.24 0 top
E16-269  [2,54/0,8]  73.66,146.05 0 top
E16-270  [2,54/0,8]  73.66,149.86 0 top
E16-271  [2,54/0,8]  73.66,153.67 0 top
E16-272  [2,54/0,8]  73.66,157.48 0 top
E16-273  [2,54/0,8]  73.66,161.29 0 top
E16-274  [2,54/0,8]  73.66,165.1 0 top
E16-275  [2,54/0,8]  106.68,134.62 0 top
E16-276  [2,54/0,8]  124.46,134.62 0 top
E16-277  [2,54/0,8]  55.88,127 0 top
E16-278  [2,54/0,8]  55.88,123.19 0 top
E16-279  [2,54/0,8]  55.88,119.38 0 top
E16-280  [2,54/0,8]  55.88,115.57 0 top
E16-281  [2,54/0,8]  55.88,111.76 0 top
E16-282  [2,54/0,8]  55.88,107.95 0 top
E16-283  [2,54/0,8]  55.88,104.14 0 top
E16-284  [2,54/0,8]  55.88,100.33 0 top
E16-285  [2,54/0,8]  73.66,100.33 0 top
E16-286  [2,54/0,8]  73.66,104.14 0 top
E16-287  [2,54/0,8]  73.66,107.95 0 top
E16-288  [2,54/0,8]  73.66,111.76 0 top
E16-289  [2,54/0,8]  73.66,115.57 0 top
E16-290  [2,54/0,8]  73.66,119.38 0 top
E16-291  [2,54/0,8]  73.66,123.19 0 top
E16-292  [2,54/0,8]  73.66,127 0 top
E16-293  [2,54/0,8]  55.88,96.52 0 top
E16-294  [2,54/0,8]  73.66,96.52 0 top
E16-295  [2,54/0,8]  30.48,127 0 top
E16-296  [2,54/0,8]  30.48,123.19 0 top
E16-297  [2,54/0,8]  30.48,119.38 0 top
E16-298  [2,54/0,8]  30.48,115.57 0 top
E16-299  [2,54/0,8]  30.48,111.76 0 top
E16-300  [2,54/0,8]  30.48,107.95 0 top
E16-301  [2,54/0,8]  30.48,104.14 0 top
E16-302  [2,54/0,8]  30.48,100.33 0 top
E16-303  [2,54/0,8]  48.26,100.33 0 top
E16-304  [2,54/0,8]  48.26,104.14 0 top
E16-305  [2,54/0,8]  48.26,107.95 0 top
E16-306  [2,54/0,8]  48.26,111.76 0 top
E16-307  [2,54/0,8]  48.26,115.57 0 top
E16-308  [2,54/0,8]  48.26,119.38 0 top
E16-309  [2,54/0,8]  48.26,123.19 0 top
E16-310  [2,54/0,8]  48.26,127 0 top
E16-311  [2,54/0,8]  30.48,96.52 0 top
E16-312  [2,54/0,8]  48.26,96.52 0 top
E16-313  [2,54/0,8]  5.08,127 0 top
E16-314  [2,54/0,8]  5.08,123.19 0 top
E16-315  [2,54/0,8]  5.08,119.38 0 top
E16-316  [2,54/0,8]  5.08,115.57 0 top
E16-317  [2,54/0,8]  5.08,111.76 0 top
E16-318  [2,54/0,8]  5.08,107.95 0 top
E16-319  [2,54/0,8]  5.08,104.14 0 top
E16-320  [2,54/0,8]  5.08,100.33 0 top
E16-321  [2,54/0,8]  22.86,100.33 0 top
E16-322  [2,54/0,8]  22.86,104.14 0 top
E16-323  [2,54/0,8]  22.86,107.95 0 top
E16-324  [2,54/0,8]  22.86,111.76 0 top
E16-325  [2,54/0,8]  22.86,115.57 0 top
E16-326  [2,54/0,8]  22.86,119.38 0 top
E16-327  [2,54/0,8]  22.86,123.19 0 top
E16-328  [2,54/0,8]  22.86,127 0 top
E16-329  [2,54/0,8]  5.08,96.52 0 top
E16-330  [2,54/0,8]  22.86,96.52 0 top
E16-331  [2,54/0,8]  228.6,193.04 0 top
E16-332  [2,54/0,8]  224.79,193.04 0 top
E16-333  [2,54/0,8]  220.98,193.04 0 top
E16-334  [2,54/0,8]  217.17,193.04 0 top
E16-335  [2,54/0,8]  213.36,193.04 0 top
E16-336  [2,54/0,8]  209.55,193.04 0 top
E16-337  [2,54/0,8]  205.74,193.04 0 top
E16-338  [2,54/0,8]  201.93,193.04 0 top
E16-339  [2,54/0,8]  201.93,175.26 0 top
E16-340  [2,54/0,8]  205.74,175.26 0 top
E16-341  [2,54/0,8]  209.55,175.26 0 top
E16-342  [2,54/0,8]  213.36,175.26 0 top
E16-343  [2,54/0,8]  217.17,175.26 0 top
E16-344  [2,54/0,8]  220.98,175.26 0 top
E16-345  [2,54/0,8]  224.79,175.26 0 top
E16-346  [2,54/0,8]  228.6,175.26 0 top
E16-347  [2,54/0,8]  198.12,193.04 0 top
E16-348  [2,54/0,8]  198.12,175.26 0 top
E17  [DIL16]  246.38,107.95 270 top
E17-1  [1,6/0,8]  233.68,116.84 0 top
E17-2  [1,6/0,8]  233.68,113.67 0 top
E17-3  [1,6/0,8]  233.68,110.49 0 top
E17-4  [1,6/0,8]  233.68,107.31 0 top
E17-5  [1,6/0,8]  233.68,104.14 0 top
E17-6  [1,6/0,8]  233.68,100.97 0 top
E17-7  [1,6/0,8]  233.68,97.79 0 top
E17-8  [1,6/0,8]  233.68,94.61 0 top
E17-9  [1,6/0,8]  233.68,91.44 0 top
E17-10  [1,6/0,8]  233.68,88.27 0 top
E17-11  [1,6/0,8]  233.68,85.09 0 top
E17-12  [1,6/0,8]  233.68,81.92 0 top
E17-13  [1,6/0,8]  258.44,81.92 180 top
E17-14  [1,6/0,8]  258.44,85.09 180 top
E17-15  [1,6/0,8]  258.44,88.27 180 top
E17-16  [1,6/0,8]  258.44,91.44 180 top
E17-17  [1,6/0,8]  258.44,94.61 180 top
E17-18  [1,6/0,8]  258.44,97.79 180 top
E17-19  [1,6/0,8]  258.44,100.97 180 top
E17-20  [1,6/0,8]  258.44,104.14 180 top
E17-21  [1,6/0,8]  258.44,107.31 180 top
E17-22  [1,6/0,8]  258.44,110.49 180 top
E17-23  [1,6/0,8]  258.44,113.67 180 top
E17-24  [1,6/0,8]  258.44,116.84 180 top
E18  [DIL16]  246.38,138.43 270 top
E18-1  [1,6/0,8]  233.68,154.94 0 top
E18-2  [1,6/0,8]  233.68,151.76 0 top
E18-3  [1,6/0,8]  233.68,148.59 0 top
E18-4  [1,6/0,8]  233.68,145.41 0 top
E18-5  [1,6/0,8]  233.68,142.24 0 top
E18-6  [1,6/0,8]  233.68,139.06 0 top
E18-7  [1,6/0,8]  233.68,135.89 0 top
E18-8  [1,6/0,8]  233.68,132.72 0 top
E18-9  [1,6/0,8]  233.68,129.54 0 top
E18-10  [1,6/0,8]  233.68,126.36 0 top
E18-11  [1,6/0,8]  233.68,123.19 0 top
E18-12  [1,6/0,8]  233.68,120.02 0 top
E18-13  [1,6/0,8]  258.44,120.02 180 top
E18-14  [1,6/0,8]  258.44,123.19 180 top
E18-15  [1,6/0,8]  258.44,126.36 180 top
E18-16  [1,6/0,8]  258.44,129.54 180 top
E18-17  [1,6/0,8]  258.44,132.72 180 top
E18-18  [1,6/0,8]  258.44,135.89 180 top
E18-19  [1,6/0,8]  258.44,139.06 180 top
E18-20  [1,6/0,8]  258.44,142.24 180 top
E18-21  [1,6/0,8]  258.44,145.41 180 top
E18-22  [1,6/0,8]  258.44,148.59 180 top
E18-23  [1,6/0,8]  258.44,151.76 180 top
E18-24  [1,6/0,8]  258.44,154.94 180 top
E19  [DIL16]  246.38,168.91 270 top
E19-1  [1,6/0,8]  233.68,193.04 0 top
E19-2  [1,6/0,8]  233.68,189.87 0 top
E19-3  [1,6/0,8]  233.68,186.69 0 top
E19-4  [1,6/0,8]  233.68,183.51 0 top
E19-5  [1,6/0,8]  233.68,180.34 0 top
E19-6  [1,6/0,8]  233.68,177.16 0 top
E19-7  [1,6/0,8]  233.68,173.99 0 top
E19-8  [1,6/0,8]  233.68,170.81 0 top
E19-9  [1,6/0,8]  233.68,167.64 0 top
E19-10  [1,6/0,8]  233.68,164.47 0 top
E19-11  [1,6/0,8]  233.68,161.29 0 top
E19-12  [1,6/0,8]  233.68,158.12 0 top
E19-13  [1,6/0,8]  258.44,158.12 180 top
E19-14  [1,6/0,8]  258.44,161.29 180 top
E19-15  [1,6/0,8]  258.44,164.47 180 top
E19-16  [1,6/0,8]  258.44,167.64 180 top
E19-17  [1,6/0,8]  258.44,170.81 180 top
E19-18  [1,6/0,8]  258.44,173.99 180 top
E19-19  [1,6/0,8]  258.44,177.16 180 top
E19-20  [1,6/0,8]  258.44,180.34 180 top
E19-21  [1,6/0,8]  258.44,183.51 180 top
E19-22  [1,6/0,8]  258.44,186.69 180 top
E19-23  [1,6/0,8]  258.44,189.87 180 top
E19-24  [1,6/0,8]  258.44,193.04 180 top
E20  [DIL16]  217.17,113.03 270 top
E21  [DIL16]  217.17,151.13 270 top
E22  [DIL16]  214.63,184.15 180 top
E23  [DIL16]  191.77,113.03 270 top
E24  [DIL16]  191.77,151.13 270 top
E25  [DIL16]  166.37,113.03 270 top
E26  [DIL16]  166.37,151.13 270 top
E27  [DIL16]  140.97,113.03 270 top
E28  [DIL16]  140.97,151.13 270 top
E29  [DIL16]  115.57,113.03 270 top
E30  [DIL16]  115.57,151.13 270 top
E31  [DIL16]  90.17,113.03 270 top
E32  [DIL16]  90.17,151.13 270 top
E33  [DIL16]  64.77,113.03 270 top
E34  [DIL16]  64.77,151.13 270 top
E35  [DIL16]  39.37,113.03 270 top
E36  [DIL16]  13.97,113.03 270 top
F  [EDGE-CON2]  133.35,214.63 270 top
FA1  [2,54/0,8]  136.53,190.5 90 top
FA2  [2,54/0,8]  136.53,184.15 90 top
FB1  [2,54/0,8]  139.7,193.68 90 top
FB2  [2,54/0,8]  139.7,187.32 90 top
FC1  [2,54/0,8]  142.88,190.5 90 top
FC2  [2,54/0,8]  142.88,184.15 90 top
FD1  [2,54/0,8]  146.05,193.68 90 top
FD2  [2,54/0,8]  146.05,187.32 90 top
FE1  [2,54/0,8]  149.22,190.5 90 top
FE2  [2,54/0,8]  149.22,184.15 90 top
FF1  [2,54/0,8]  152.4,193.68 90 top
FF2  [2,54/0,8]  152.4,187.32 90 top
FH1  [2,54/0,8]  155.57,190.5 90 top
FH2  [2,54/0,8]  155.57,184.15 90 top
FJ1  [2,54/0,8]  158.75,193.68 90 top
FJ2  [2,54/0,8]  158.75,187.32 90 top
FK1  [2,54/0,8]  161.93,190.5 90 top
FK2  [2,54/0,8]  161.93,184.15 90 top
FL1  [2,54/0,8]  165.1,193.68 90 top
FL2  [2,54/0,8]  165.1,187.32 90 top
FM1  [2,54/0,8]  168.28,190.5 90 top
FM2  [2,54/0,8]  168.28,184.15 90 top
FN1  [2,54/0,8]  171.45,193.68 90 top
FN2  [2,54/0,8]  171.45,187.32 90 top
FP1  [2,54/0,8]  174.62,190.5 90 top
FP2  [2,54/0,8]  174.62,184.15 90 top
FR1  [2,54/0,8]  177.8,193.68 90 top
FR2  [2,54/0,8]  177.8,187.32 90 top
FS1  [2,54/0,8]  180.97,190.5 90 top
FS2  [2,54/0,8]  180.97,184.15 90 top
FT1  [2,54/0,8]  184.15,193.68 90 top
FT2  [2,54/0,8]  184.15,187.32 90 top
FU1  [2,54/0,8]  187.32,190.5 90 top
FU2  [2,54/0,8]  187.32,184.15 90 top
FV1  [2,54/0,8]  190.5,193.68 0 top
FV2  [2,54/0,8]  190.5,187.32 90 top
H  [EDGE-CON2]  69.85,214.63 270 top
HA1  [2,54/0,8]  73.03,190.5 90 top
HA2  [2,54/0,8]  73.03,184.15 90 top
HB1  [2,54/0,8]  76.2,193.68 90 top
HB2  [2,54/0,8]  76.2,187.32 90 top
HC1  [2,54/0,8]  79.38,190.5 90 top
HC2  [2,54/0,8]  79.38,184.15 90 top
HD1  [2,54/0,8]  82.55,193.68 90 top
HD2  [2,54/0,8]  82.55,187.32 90 top
HE1  [2,54/0,8]  85.72,190.5 90 top
HE2  [2,54/0,8]  85.72,184.15 90 top
HF1  [2,54/0,8]  88.9,193.68 90 top
HF2  [2,54/0,8]  88.9,187.32 90 top
HH1  [2,54/0,8]  92.08,190.5 90 top
HH2  [2,54/0,8]  92.08,184.15 90 top
HJ1  [2,54/0,8]  95.25,193.68 90 top
HJ2  [2,54/0,8]  95.25,187.32 90 top
HK1  [2,54/0,8]  98.42,190.5 90 top
HK2  [2,54/0,8]  98.42,184.15 90 top
HL1  [2,54/0,8]  101.6,193.68 90 top
HL2  [2,54/0,8]  101.6,187.32 90 top
HM1  [2,54/0,8]  104.78,190.5 90 top
HM2  [2,54/0,8]  104.78,184.15 90 top
HN1  [2,54/0,8]  107.95,193.68 90 top
HN2  [2,54/0,8]  107.95,187.32 90 top
HP1  [2,54/0,8]  111.12,190.5 90 top
HP2  [2,54/0,8]  111.12,184.15 90 top
HR1  [2,54/0,8]  114.3,193.68 90 top
HR2  [2,54/0,8]  114.3,187.32 90 top
HS1  [2,54/0,8]  117.47,190.5 90 top
HS2  [2,54/0,8]  117.47,184.15 90 top
HT1  [2,54/0,8]  120.65,193.68 90 top
HT2  [2,54/0,8]  120.65,187.32 90 top
HU1  [2,54/0,8]  123.83,190.5 90 top
HU2  [2,54/0,8]  123.83,184.15 90 top
HV1  [2,54/0,8]  127,193.68 90 top
HV2  [2,54/0,8]  127,187.32 90 top
J1  [DEC40PINH]  26.67,166.37 90 top
J1BB  [2,54/0,8]  38.1,161.29 0 top
J1BB1  [2,54/0,8]  45.72,161.29 0 top
J1D  [2,54/0,8]  38.1,199.39 0 top
J1D1  [2,54/0,8]  45.72,199.39 0 top
J1DD  [2,54/0,8]  38.1,157.48 0 top
J1DD1  [2,54/0,8]  45.72,157.48 0 top
J1F  [2,54/0,8]  38.1,195.58 0 top
J1F1  [2,54/0,8]  45.72,195.58 0 top
J1FF  [2,54/0,8]  38.1,153.67 0 top
J1FF1  [2,54/0,8]  45.72,153.67 0 top
J1J  [2,54/0,8]  38.1,191.77 0 top
J1J1  [2,54/0,8]  45.72,191.77 0 top
J1JJ  [2,54/0,8]  38.1,149.86 0 top
J1JJ1  [2,54/0,8]  45.72,149.86 0 top
J1L  [2,54/0,8]  38.1,187.96 0 top
J1L1  [2,54/0,8]  45.72,187.96 0 top
J1LL  [2,54/0,8]  38.1,146.05 0 top
J1LL1  [2,54/0,8]  45.72,146.05 0 top
J1N  [2,54/0,8]  38.1,184.15 0 top
J1N1  [2,54/0,8]  45.72,184.15 0 top
J1NN  [2,54/0,8]  38.1,142.24 0 top
J1NN1  [2,54/0,8]  45.72,142.24 0 top
J1R  [2,54/0,8]  38.1,180.34 0 top
J1R1  [2,54/0,8]  45.72,180.34 0 top
J1RR  [2,54/0,8]  38.1,138.43 0 top
J1RR1  [2,54/0,8]  45.72,138.43 0 top
J1T  [2,54/0,8]  38.1,176.53 0 top
J1T1  [2,54/0,8]  45.72,176.53 0 top
J1TT  [2,54/0,8]  38.1,134.62 0 top
J1TT1  [2,54/0,8]  45.72,134.62 0 top
J1V  [2,54/0,8]  38.1,172.72 0 top
J1V1  [2,54/0,8]  45.72,172.72 0 top
J1X  [2,54/0,8]  38.1,168.91 0 top
J1X1  [2,54/0,8]  45.72,168.91 0 top
J1Z  [2,54/0,8]  38.1,165.1 0 top
J1Z1  [2,54/0,8]  45.72,165.1 0 top
R1  2.2K  [0207/10]  132.08,76.2 270 top
R2  2.2K  [0207/10]  182.88,76.2 270 top
R3  2.2K  [0207/10]  175.26,71.12 270 top
R4  2.2K  [0207/10]  223.52,76.2 270 top
R5  390  [0207/10]  91.44,76.2 90 top
R6  750  [0207/10]  86.36,76.2 270 top
R7  390  [0207/10]  93.98,76.2 90 top
R8  750  [0207/10]  88.9,76.2 270 top
SV1  [MA12-1]  238.76,102.87 270 top
SV2  [MA12-1]  254,102.87 270 top
SV3  [MA12-1]  238.76,133.35 270 top
SV4  [MA12-1]  254,133.35 270 top
SV5  [MA12-1]  238.76,163.83 270 top
SV6  [MA12-1]  254,163.83 270 top
SV7  [MA08-1]  254,77.47 270 top
SV8  [MA08-1]  238.76,77.47 270 top
SV9  1-8  [MA08-1]  13.97,43.18 0 top
SV10  9-16  [MA08-1]  13.97,50.8 0 top
SV11  19-26  [MA08-1]  39.37,88.9 0 top
SV12  31-39  [MA09-1]  111.76,88.9 0 top
SV13  41-47  [MA07-1]  139.7,88.9 0 top
SV14  48-54  [MA07-1]  165.1,88.9 0 top
SV15  55-61  [MA07-1]  190.5,88.9 0 top
SV16  62-68  [MA07-1]  215.9,88.9 0 top
U$2  [EDGE-CON8]  0,0 0 top
U$6  [2,8]  5.71,209.55 0 top
U$7  [2,8]  56.52,209.55 0 top
U$8  [2,8]  259.71,209.55 0 top
U$9  [2,8]  208.91,209.55 0 top

## Tracks (layer width: path | path; a pad name or v marks a point on that pad's centre or on a via)
!#41_RECH  (via drill 0.81)
  Top 0.406: SV13.1 R1.1 133.35,80.01 v133.35,66.04 | E4.7 161.29,67.31 161.29,69.85 E4.5
  Bottom 0.406: 190.5,43.18 193.04,45.72 E1.10 | 190.5,43.18 E1.7 | 190.5,43.18 189.23,44.45 | 189.23,44.45 E1.5 | 189.23,44.45 E1.12 200.66,50.8 200.66,52.7 193.68,59.69 168.91,59.69 165.1,63.5 | 165.1,63.5 E4.7 | v133.35,66.04 135.89,63.5 165.1,63.5
!#54_RECL  (via drill 0.81)
  Top 0.406: E10.12 69.85,49.53 69.85,46.99 E10.10 | E4.10 168.91,72.39 168.91,74.93 E4.12 171.45,77.47 171.45,87.63 SV14.7 172.72,90.17 v168.91,93.98 | v65.41,53.98 66.04,54.61 v66.04,88.27
  Bottom 0.406: 63.5,43.18 66.04,45.72 E10.10 | 63.5,43.18 E10.7 | 63.5,43.18 E10.5 | E4.12 R3.1 | v65.41,53.98 E10.12 | v66.04,88.27 71.12,93.34 139.7,93.34 140.97,94.61 153.03,94.61 156.84,98.42 162.56,98.42 165.74,95.25 167.64,95.25 v168.91,93.98
!BREAK_CYCLE  (via drill 0.81)
  Top 0.406: BUS43.1 161.29,24.77 v161.29,15.24
  Bottom 0.406: v161.29,15.24 161.93,15.24 162.56,14.61 162.56,8.26 U$2.BL2
!BRK_DATA_CONT  (via drill 0.81)
  Top 0.406: BUS44.1 164.47,21.59 v164.47,15.24
  Bottom 0.406: v164.47,15.24 165.1,15.24 165.74,14.61 165.74,8.26 U$2.BK2
!BRK_IN_PROG  (via drill 0.81)
  Top 0.406: v177.8,17.78 BUS48.1
  Bottom 0.406: v177.8,17.78 177.8,15.24 178.44,14.61 178.44,8.26 U$2.BE2
!BUS_STROBE
  Top 0.406: BUS61.1 102.87,27.3 102.87,23.5 103.5,22.86 103.5,15.24 102.87,14.61 102.87,8.26 U$2.CK1
!C0  (via drill 0.81)
  Top 0.406: v115.57,78.74 115.57,31.75 114.3,30.48 BUS65.1 114.3,26.04 116.2,24.13 116.2,21.59 115.57,20.95 115.57,8.26 U$2.CE1
  Bottom 0.406: E8.1 114.3,78.74 v115.57,78.74
!C1  (via drill 0.81)
  Top 0.406: E8.4 113.03,72.39 113.03,63.5 109.22,59.69 109.22,52.7 105.41,48.9 105.41,33.66 107.95,31.11 BUS63.1 | v109.86,23.5 109.86,21.59 109.22,20.95 109.22,8.26 U$2.CH1
  Bottom 0.406: v109.86,23.5 107.95,25.4 BUS63.1
!C2  (via drill 0.81)
  Top 0.406: v101.6,69.85 101.6,34.92 BUS62.1 104.78,29.21 106.68,27.3 106.68,24.77 106.05,24.13 106.05,8.26 U$2.CJ1
  Bottom 0.406: E8.10 118.11,72.39 104.14,72.39 v101.6,69.85
!CPMA_DISABLE
  Top 0.406: BUS53.1 76.83,27.94 76.83,8.26 U$2.CU1
!DATA0  (via drill 0.81)
  Top 0.406: E1.4 189.23,49.53 189.23,80.01 E2.1 | BUS19.1 219.71,24.77 219.71,8.26 U$2.AR1 | v199.39,52.07 219.07,32.38 BUS5.1
  Bottom 0.406: BUS19.1 220.34,26.67 222.88,26.67 224.16,27.94 224.16,30.48 220.34,30.48 BUS5.1 | E1.4 191.77,52.07 v199.39,52.07
!DATA1  (via drill 0.81)
  Top 0.406: E2.4 186.69,72.39 186.69,44.45 E1.6 v197.49,33.66 | BUS4.1 216.53,27.94 216.53,8.26 U$2.AS1
  Bottom 0.406: v197.49,33.66 208.28,33.66 213.36,28.57 BUS4.1
!DATA2  (via drill 0.81)
  Top 0.406: U$2.AU1 210.19,8.26 210.19,27.94 BUS2.1 209.55,38.1 v208.91,38.73
  Bottom 0.406: 200.03,47.62 201.93,49.53 201.93,69.85 196.85,69.85 E2.10 | 200.03,47.62 E1.9 | v208.91,38.73 200.03,47.62
!DATA3
  Top 0.406: 198.12,45.72 E1.11 | 198.12,45.72 198.12,40.01 204.47,33.66 | BUS1.1 204.47,33.66 | E2.13 198.12,76.2 198.12,45.72 | 204.47,33.66 204.47,24.77 207.01,22.23 207.01,8.26 U$2.AV1
!DATA4  (via drill 0.81)
  Top 0.406: E4.4 158.12,69.22 v158.12,66.04 | E6.1 134.62,78.74 v134.62,76.2 | v143.51,74.93 151.13,74.93 v151.13,64.77 149.22,62.87 BUS29.1 149.22,26.67 149.86,26.04 149.86,8.26 U$2.BR1
  Bottom 0.406: v158.12,66.04 156.84,64.77 v151.13,64.77 | v134.62,76.2 135.89,74.93 v143.51,74.93
!DATA5  (via drill 0.81)
  Top 0.406: E6.4 138.43,72.39 138.43,70.48 137.79,69.85 135.89,69.85 v135.89,67.31 135.89,64.77 140.97,59.69 140.97,36.2 146.05,31.11 BUS28.1 146.69,27.94 146.69,8.26 U$2.BS1
  Bottom 0.406: E4.6 146.69,68.58 145.41,67.31 v135.89,67.31
!DATA6  (via drill 0.81)
  Top 0.406: E6.10 v148.59,67.31 147.32,66.04 v147.32,59.69 | U$2.BU1 140.34,8.26 140.34,27.94 BUS26.1 139.7,59.05 v139.06,59.69
  Bottom 0.406: v148.59,67.31 165.74,67.31 167,68.58 E4.9 | v139.06,59.69 v147.32,59.69
!DATA7  (via drill 0.81)
  Top 0.406: v153.67,76.2 153.67,57.78 155.57,55.88 | 155.57,55.88 156.84,54.61 160.02,54.61 160.02,57.78 169.54,67.31 171.45,67.31 171.45,72.39 E4.11 | BUS25.1 137.16,31.11 137.16,8.26 U$2.BV1 | 155.57,55.88 151.13,51.44 151.13,29.84 150.5,29.21 v150.5,27.3
  Bottom 0.406: E6.13 147.32,76.2 v153.67,76.2 | v150.5,27.3 149.86,26.67 144.15,26.67 139.06,31.75 BUS25.1
!DATA8
  Top 0.406: E11.1 62.23,80.01 62.23,49.53 E10.4 | BUS87.1 16.51,31.11 16.51,8.26 U$2.DR1
  Bottom 0.406: E10.4 53.34,40.64 52.07,40.64 48.26,36.83 20.95,36.83 BUS87.1
!DATA9
  Top 0.406: E11.4 59.69,72.39 59.69,44.45 E10.6 | BUS86.1 13.34,27.94 13.34,8.26 U$2.DS1
  Bottom 0.406: E10.6 57.15,39.37 52.07,39.37 48.26,35.56 22.23,35.56 15.24,28.57 BUS86.1
!DATA10  (via drill 0.81)
  Top 0.406: E11.10 68.58,70.48 71.12,67.94 71.12,45.72 E10.9 66.04,40.64 v66.04,19.68 | BUS84.1 6.99,27.94 v6.99,18.41 6.99,8.26 U$2.DU1
  Bottom 0.406: v66.04,19.68 64.77,18.41 v6.99,18.41
!DATA11  (via drill 0.81)
  Top 0.406: E10.11 67.31,49.53 67.31,77.47 E11.13 | BUS83.1 3.81,31.11 3.81,8.26 U$2.DV1 | v55.88,78.74 49.53,72.39 49.53,43.81 38.73,33.02 v38.73,19.68
  Bottom 0.406: E11.13 67.31,80.01 57.15,80.01 v55.88,78.74 | v38.73,19.68 12.7,19.68 3.17,29.21 BUS83.1
!INT_RQST  (via drill 0.81)
  Top 0.406: E7.10 120.65,44.45 120.65,37.47 v116.84,33.66 | BUS57.1 88.9,26.04 90.81,24.13 90.81,21.59 90.17,20.95 90.17,8.26 U$2.CP1
  Bottom 0.406: v116.84,33.66 96.52,33.66 91.44,28.57 BUS57.1
!INTERNAL_IO  (via drill 0.81)
  Top 0.406: v100.33,52.07 98.42,50.16 BUS60.1 98.42,29.21 100.33,27.3 100.33,24.77 99.69,24.13 99.69,8.26 U$2.CL1
  Bottom 0.406: E7.1 109.22,53.34 101.6,53.34 v100.33,52.07
!IO_PAUSE  (via drill 0.81)
  Top 0.406: E9.11 97.16,42.55 v97.16,39.37 | v125.09,37.47 127,35.56 127,31.11 | BUS66.1 127,31.11 | 127,31.11 118.75,22.86 118.75,8.26 U$2.CD1
  Bottom 0.406: v97.16,39.37 97.79,38.73 114.3,38.73 115.57,37.47 v125.09,37.47
!LINK  (via drill 0.81)
  Top 0.406: BUS17.1 208.28,23.5 v208.28,19.05
  Bottom 0.406: v208.28,19.05 208.28,15.24 207.65,14.61 207.65,8.26 U$2.AV2
!LINK_DATA  (via drill 0.81)
  Top 0.406: v85.72,20.95 BUS70.1 | v91.44,15.88 v91.44,20.32
  Bottom 0.406: v85.72,20.95 86.36,20.32 v91.44,20.32 | v91.44,15.88 90.81,16.51 87.63,16.51 87,15.88 87,8.26 U$2.CR2
!LINK_LOAD  (via drill 0.81)
  Top 0.406: BUS69.1 84.45,20.32 v84.45,16.51
  Bottom 0.406: v84.45,16.51 84.45,15.24 83.82,14.61 83.82,8.26 U$2.CS2
!LOAD_CONT  (via drill 0.81)
  Top 0.406: BUS46.1 170.81,21.59 v170.81,15.24
  Bottom 0.406: v170.81,15.24 171.45,15.24 172.09,14.61 172.09,8.26 U$2.BH2
!MA00
  Top 0.406: BUS15.1 251.46,31.11 251.46,8.26 U$2.AD1
!MA01
  Top 0.406: BUS14.1 248.28,27.94 248.28,8.26 U$2.AE1
!MA02
  Top 0.406: BUS12.1 241.94,27.94 241.94,8.26 U$2.AH1
!MA03
  Top 0.406: BUS11.1 238.76,31.11 238.76,8.26 U$2.AJ1
!MA04
  Top 0.406: BUS39.1 182.25,30.48 182.25,26.67 182.88,26.04 182.88,23.5 182.25,22.86 182.25,8.26 U$2.BD1
!MA05
  Top 0.406: BUS38.1 179.07,27.3 179.07,23.5 179.71,22.86 179.71,15.24 179.07,14.61 179.07,8.26 U$2.BE1
!MA06
  Top 0.406: BUS36.1 172.72,27.3 172.72,23.5 173.35,22.86 173.35,15.24 172.72,14.61 172.72,8.26 U$2.BH1
!MA08
  Top 0.406: BUS101.1 48.26,24.77 48.26,8.26 U$2.DD1
!MA09
  Top 0.406: BUS100.1 45.09,21.59 45.09,8.26 U$2.DE1
!MA10
  Top 0.406: BUS98.1 37.47,22.86 37.47,15.88 38.73,14.61 38.73,8.26 U$2.DH1
!MA11
  Top 0.406: BUS93.1 33.66,30.48 33.66,26.67 33.02,26.04 33.02,24.77 35.56,22.23 35.56,8.26 U$2.DJ1
!MD00
  Top 0.406: BUS10.1 236.85,26.67 236.85,15.24 236.22,14.61 236.22,8.26 U$2.AK1
!MD01
  Top 0.406: BUS9.1 232.41,31.11 232.41,8.26 U$2.AL1
!MD02
  Top 0.406: BUS8.1 229.24,27.94 229.24,8.26 U$2.AM1
!MD03  (via drill 0.81)
  Top 0.406: E5.5 138.43,46.35 v138.43,43.18 | BUS6.1 222.88,27.94 222.88,8.26 U$2.AP1
  Bottom 0.406: v138.43,43.18 144.15,37.47 196.85,37.47 199.39,34.92 213.36,34.92 219.71,28.57 BUS6.1
!MD04  (via drill 0.81)
  Top 0.406: v152.4,50.8 160.02,43.18 160.02,36.2 165.1,31.11 BUS34.1 165.1,26.04 167,24.13 167,21.59 166.37,20.95 166.37,8.26 U$2.BK1
  Bottom 0.406: E5.3 137.79,52.07 149.22,52.07 150.5,50.8 v152.4,50.8
!MD05  (via drill 0.81)
  Top 0.406: v147.32,53.34 147.96,52.7 v147.96,36.2 | BUS33.1 161.93,29.21 163.83,27.3 163.83,24.77 163.19,24.13 163.19,8.26 U$2.BL1
  Bottom 0.406: E5.1 140.34,54.61 146.05,54.61 v147.32,53.34 | v147.96,36.2 149.22,34.92 158.75,34.92 BUS33.1
!MD06  (via drill 0.81)
  Top 0.406: E9.1 88.9,55.88 v88.9,35.56 | BUS32.1 159.38,27.94 159.38,8.26 U$2.BM1
  Bottom 0.406: v88.9,35.56 89.53,36.2 146.05,36.2 148.59,33.66 151.13,33.66 156.21,28.57 BUS32.1
!MD07  (via drill 0.81)
  Top 0.406: E9.3 87.63,52.07 v87.63,34.29 | BUS30.1 153.03,27.94 153.03,8.26 U$2.BP1
  Bottom 0.406: v87.63,34.29 95.89,34.29 96.52,34.92 143.51,34.92 149.86,28.57 BUS30.1
!MD08
  Top 0.406: BUS92.1 31.75,24.77 32.38,24.13 32.38,8.26 U$2.DK1
  Bottom 0.406: E9.5 85.09,46.99 76.83,46.99 64.14,34.29 50.16,34.29 45.72,29.84 33.02,29.84 BUS92.1
!MD09  (via drill 0.81)
  Top 0.406: v24.13,49.53 28.57,45.09 BUS91.1 29.21,31.11 29.21,8.26 U$2.DL1
  Bottom 0.406: E14.3 11.43,77.47 11.43,72.39 9.53,72.39 6.35,69.22 6.35,49.53 v24.13,49.53
!MD10  (via drill 0.81)
  Top 0.406: v20.95,74.93 21.59,74.3 21.59,34.92 25.4,31.11 BUS90.1 26.04,27.94 26.04,8.26 U$2.DM1
  Bottom 0.406: E14.2 16.51,74.93 v20.95,74.93
!MD11
  Top 0.406: BUS88.1 19.68,27.3 19.68,8.26 U$2.DP1
  Bottom 0.406: E14.1 8.89,83.82 3.81,78.74 3.81,33.66 5.08,33.66 12.06,26.67 17.78,26.67 BUS88.1
!MD_DIR  (via drill 0.81)
  Top 0.406: v234.95,16.51 BUS21.1
  Bottom 0.406: v234.95,16.51 234.95,15.24 235.59,14.61 235.59,8.26 U$2.AK2
!MS_DISABLE
  Top 0.406: BUS52.1 73.66,31.11 73.66,8.26 U$2.CV1
!NOT_LAST_TR
  Top 0.406: BUS59.1 96.52,27.3 96.52,23.5 97.16,22.86 97.16,15.24 96.52,14.61 96.52,8.26 U$2.CM1
!OVERFLOW  (via drill 0.81)
  Top 0.406: BUS45.1 168.28,15.88 v167.64,15.24
  Bottom 0.406: v167.64,15.24 168.28,15.24 168.91,14.61 168.91,8.26 U$2.BJ2
!SKIP  (via drill 0.81)
  Top 0.406: v104.78,52.07 104.14,51.44 v104.14,37.47 | BUS55.1 82.55,26.04 80.64,24.13 80.64,21.59 83.19,19.05 83.19,8.26 U$2.CS1
  Bottom 0.406: E7.13 118.11,52.07 v104.78,52.07 | v104.14,37.47 88.9,37.47 82.55,31.11 BUS55.1
!TS1  (via drill 0.81)
  Top 0.406: v101.6,17.78 BUS75.1
  Bottom 0.406: v101.6,17.78 101.6,15.24 102.23,14.61 102.23,8.26 U$2.CK2
!TS2  (via drill 0.81)
  Top 0.406: v98.42,17.78 BUS74.1
  Bottom 0.406: v98.42,17.78 98.42,15.24 99.06,14.61 99.06,8.26 U$2.CL2
!TS3  (via drill 0.81)
  Top 0.406: v95.25,17.78 BUS73.1
  Bottom 0.406: v95.25,17.78 95.25,15.24 95.89,14.61 95.89,8.26 U$2.CM2
!TS4  (via drill 0.81)
  Top 0.406: BUS71.1 88.27,21.59 v88.27,15.24
  Bottom 0.406: v88.27,15.24 88.9,15.24 89.53,14.61 89.53,8.26 U$2.CP2
#31_INT_ENABLE
  Top 0.406: E7.8 116.84,43.18 116.84,87 115.57,88.27 115.57,89.53 113.67,91.44 101.6,91.44 SV12.1
#32_RQST  (via drill 0.81)
  Top 0.406: SV12.2 102.87,87.63 v102.87,46.99
  Bottom 0.406: E7.9 118.11,44.45 118.11,46.99 | 118.11,46.99 118.11,48.26 E7.11 | 118.11,46.99 v102.87,46.99
#33_SKIP_IOT  (via drill 0.81)
  Top 0.406: E7.12 118.11,52.07 118.11,62.87 120.65,65.41 v120.65,86.36
  Bottom 0.406: v120.65,86.36 120.65,90.17 107.95,90.17 SV12.3
#35_C0B
  Top 0.406: E8.3 110.49,77.47 110.49,87.63 SV12.5
#36_C1A
  Top 0.406: E8.5 110.49,72.39 110.49,74.3 111.12,74.93 114.3,74.93 SV12.6
#37_C1B  (via drill 0.81)
  Top 0.406: E8.6 109.22,71.12 v109.22,86.36
  Bottom 0.406: v109.22,86.36 110.49,87.63 115.57,87.63 SV12.7
#38_C2A
  Top 0.406: E8.8 118.11,67.31 118.11,87.63 SV12.8
#39_C2B  (via drill 0.81)
  Top 0.406: SV12.9 v121.92,68.58
  Bottom 0.406: v121.92,68.58 E8.9
#42  (via drill 0.81)
  Top 0.406: v142.88,57.15 142.24,57.78 142.24,87 143.51,88.27 143.51,89.53 142.88,90.17 134.62,90.17 SV13.2
  Bottom 0.406: E1.3 186.69,52.07 150.5,52.07 145.41,57.15 v142.88,57.15
#43  (via drill 0.81)
  Top 0.406: v155.57,59.69 154.94,60.33 154.94,83.19 v151.13,87
  Bottom 0.406: E1.2 186.69,54.61 156.84,54.61 155.57,55.88 v155.57,59.69 | v151.13,87 150.5,86.36 139.7,86.36 SV13.3
#44  (via drill 0.81)
  Top 0.406: v190.5,60.96 E1.14 | v167.64,67.31 163.83,71.12 163.83,81.92 158.12,87.63 152.4,87.63 148.59,91.44 133.35,91.44 133.35,88.27 133.99,87.63 139.7,87.63 SV13.4
  Bottom 0.406: v190.5,60.96 184.15,67.31 v167.64,67.31
#45  (via drill 0.81)
  Top 0.406: v152.4,62.23 152.4,83.82 v148.59,87.63
  Bottom 0.406: E1.13 190.5,58.42 161.29,58.42 157.48,62.23 v152.4,62.23 | v148.59,87.63 143.51,87.63 SV13.5
#46  (via drill 0.81)
  Top 0.406: v148.59,78.74 146.05,81.28 146.05,87.63 SV13.6
  Bottom 0.406: E4.3 160.02,78.74 v148.59,78.74
#47  (via drill 0.81)
  Top 0.406: v149.86,80.01 147.32,82.55 SV13.7
  Bottom 0.406: E4.2 161.29,80.01 v149.86,80.01
#48  (via drill 0.81)
  Top 0.406: v166.37,85.09 E4.14
  Bottom 0.406: v166.37,85.09 163.83,87.63 158.75,87.63 SV14.1
#49
  Top 0.406: SV14.2 E4.13
#50  (via drill 0.81)
  Top 0.406: v58.42,86.36 v58.42,50.8 | v154.94,98.42 161.29,98.42 161.29,90.17 SV14.3
  Bottom 0.406: v58.42,50.8 E10.3 | v58.42,86.36 66.67,94.61 139.06,94.61 142.88,98.42 v154.94,98.42
#51  (via drill 0.81)
  Top 0.406: v57.15,54.61 57.15,90.81 63.5,97.16 v63.5,97.79 | v161.29,99.69 165.1,95.89 SV14.4
  Bottom 0.406: E10.2 59.69,54.61 v57.15,54.61 | v63.5,97.79 67.94,102.23 158.75,102.23 v161.29,99.69
#52  (via drill 0.81)
  Top 0.406: v74.93,55.88 74.93,87.63 75.56,88.27 v75.56,105.41 | v166.37,96.52 167.64,95.25 SV14.5
  Bottom 0.406: v74.93,55.88 E10.14 | v75.56,105.41 76.2,106.05 83.82,106.05 85.72,107.95 95.89,107.95 97.79,106.05 109.22,106.05 111.12,107.95 121.28,107.95 123.19,106.05 134.62,106.05 136.53,107.95 146.69,107.95 148.59,106.05 160.02,106.05 161.93,107.95 163.19,107.95 166.37,104.78 v166.37,96.52
#53  (via drill 0.81)
  Top 0.406: v64.77,85.09 v64.77,57.15 | v166.37,93.98 166.37,88.27 167,87.63 170.18,87.63 SV14.6
  Bottom 0.406: v64.77,57.15 E10.13 | v64.77,85.09 71.75,92.08 139.7,92.08 140.97,93.34 157.48,93.34 158.12,93.98 v166.37,93.98
#55_ENBH
  Top 0.406: R2.1 SV15.1 | E6.5 135.89,72.39 135.89,77.47 E6.2 | E2.11 194.31,72.39 194.31,67.31 E2.8
  Bottom 0.406: R2.1 185.42,81.28 E2.2 189.23,77.47 201.93,77.47 201.93,73.03 201.29,72.39 200.03,72.39 198.75,73.66 E2.11 | E2.8 194.31,67.31 187.32,67.31 186.69,67.94 186.69,69.85 | 186.69,69.85 186.69,71.12 E2.5 | E6.5 142.88,71.12 144.15,69.85 186.69,69.85
#56
  Top 0.406: E2.3 185.42,78.74 SV15.2
#57  (via drill 0.81)
  Top 0.406: v190.5,73.66 190.5,86.36 SV15.3
  Bottom 0.406: E2.6 190.5,71.12 v190.5,73.66
#58
  Top 0.406: E2.9 196.85,69.85 196.85,74.3 196.22,74.93 191.77,74.93 191.77,87.63 SV15.4
#59
  Top 0.406: E2.12 193.04,78.74 SV15.5
#60  (via drill 0.81)
  Top 0.406: E6.3 139.7,78.74 v139.7,82.55
  Bottom 0.406: v139.7,82.55 142.24,85.09 151.76,85.09 158.12,91.44 192.41,91.44 194.94,88.9 SV15.6
#61  (via drill 0.81)
  Top 0.406: E6.6 140.97,68.58 v140.97,87.63
  Bottom 0.406: v140.97,87.63 140.97,92.08 157.48,92.08 158.12,92.71 192.41,92.71 194.94,90.17 196.85,90.17 SV15.7
#62  (via drill 0.81)
  Top 0.406: E6.8 146.05,64.77 v146.05,48.26 | v172.09,44.45 173.99,44.45 173.99,70.48 184.15,80.64 184.15,89.53 184.78,90.17 208.28,90.17 SV16.1
  Bottom 0.406: v146.05,48.26 149.86,44.45 v172.09,44.45
#63  (via drill 0.81)
  Top 0.406: SV16.2 v205.74,83.82